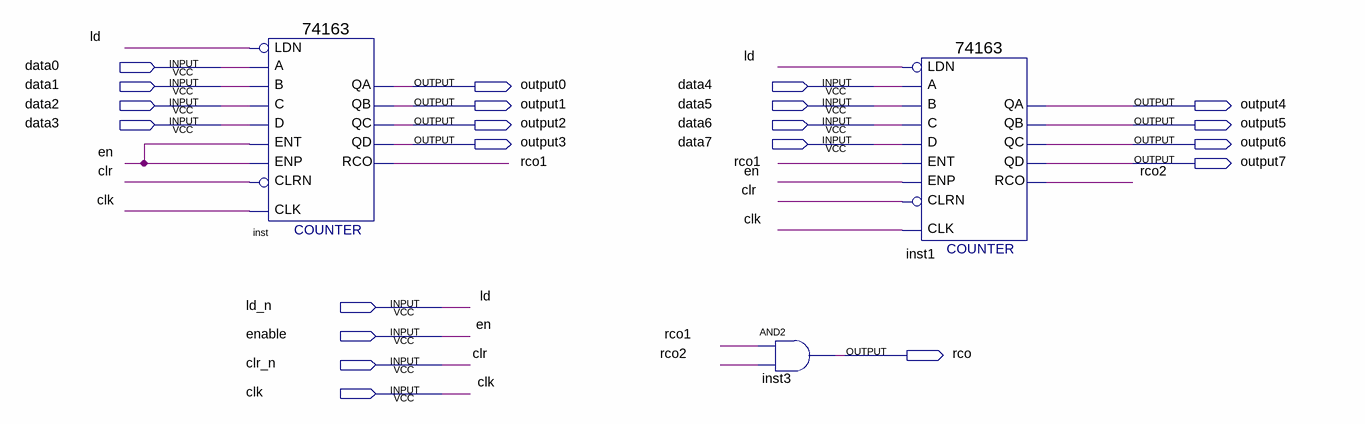
[diagram p0: schematic sheet]
// Quartus schematic counter.bdf as structural Verilog: 3 symbols, 21 pins
module counter (
  input  data0,
  input  data1,
  input  data4,
  input  data2,
  input  data5,
  input  data3,
  input  data6,
  input  data7,
  input  ld_n,
  input  enable,
  input  clr_n,
  input  clk,
  output output0,
  output output1,
  output output4,
  output output2,
  output output5,
  output output3,
  output output6,
  output output7,
  output rco
);

  wire rco1, rco2;

  \74163  inst (
    .C(data2), .B(data1), .A(data0), .ENT(enable), .D(data3), .CLRN(clr_n), .CLK(clk), .ENP(enable),
    .LDN(ld_n), .QA(output0), .QB(output1), .QC(output2), .QD(output3), .RCO(rco1));
  and inst3 (rco, rco1, rco2);
  \74163  inst1 (
    .C(data6), .B(data5), .A(data4), .ENT(rco1), .D(data7), .CLRN(clr_n), .CLK(clk), .ENP(enable),
    .LDN(ld_n), .QA(output4), .QB(output5), .QC(output6), .QD(output7), .RCO(rco2));

  // Other names for the same wires on the sheet: clr = clr_n; en = enable; ld = ld_n
endmodule
